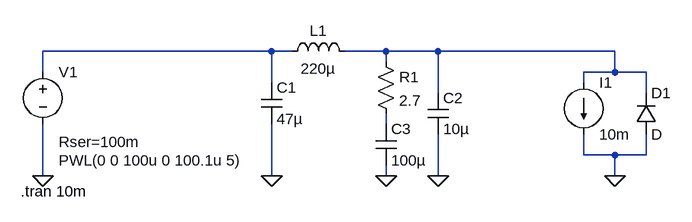
[diagram p0: schematic lc_lowpass_2th_order.asc]
lc_lowpass_2th_order.asc, the LTspice schematic file:
Version 4
SHEET 1 940 680
WIRE 320 128 -32 128
WIRE 352 128 320 128
WIRE 496 128 432 128
WIRE 576 128 496 128
WIRE 848 128 576 128
WIRE 496 144 496 128
WIRE -32 160 -32 128
WIRE 848 160 848 128
WIRE 848 160 800 160
WIRE 896 160 848 160
WIRE 320 176 320 128
WIRE 800 176 800 160
WIRE 576 192 576 128
WIRE 896 192 896 160
WIRE 496 240 496 224
WIRE 800 288 800 256
WIRE 848 288 800 288
WIRE 896 288 896 256
WIRE 896 288 848 288
WIRE -32 320 -32 240
WIRE 320 320 320 240
WIRE 496 320 496 304
WIRE 576 320 576 256
WIRE 848 320 848 288
FLAG 320 320 0
FLAG 496 320 0
FLAG 576 320 0
FLAG 848 320 0
FLAG -32 320 0
SYMBOL voltage -32 144 R0
WINDOW 3 24 152 Left 2
WINDOW 123 0 0 Left 2
WINDOW 39 24 124 Left 2
SYMATTR InstName V1
SYMATTR Value PWL(0 0 100u 0 100.1u 5)
SYMATTR SpiceLine Rser=100m
SYMBOL cap 304 176 R0
SYMATTR InstName C1
SYMATTR Value 47µ
SYMBOL ind 336 144 R270
WINDOW 0 32 56 VTop 2
WINDOW 3 5 56 VBottom 2
SYMATTR InstName L1
SYMATTR Value 220µ
SYMBOL cap 560 192 R0
SYMATTR InstName C2
SYMATTR Value 10µ
SYMBOL cap 480 240 R0
SYMATTR InstName C3
SYMATTR Value 100µ
SYMBOL res 480 128 R0
SYMATTR InstName R1
SYMATTR Value 2.7
SYMBOL current 800 176 R0
SYMATTR InstName I1
SYMATTR Value 10m
SYMBOL diode 880 256 M180
WINDOW 0 24 64 Left 2
WINDOW 3 24 0 Left 2
SYMATTR InstName D1
TEXT -66 344 Left 2 !.tran 10m

The netlist it stands for:
* lc_lowpass_2th_order.asc
V1 N001 0 PWL(0 0 100u 0 100.1u 5) Rser=100m
C1 N001 0 47µ
L1 N001 N002 220µ
C2 N002 0 10µ
C3 N003 0 100µ
R1 N002 N003 2.7
I1 N002 0 10m
D1 0 N002 D
.model D D
.lib standard.dio
.tran 10m
.backanno
.end